# Altium project PCB_Linefollower.PrjPcb
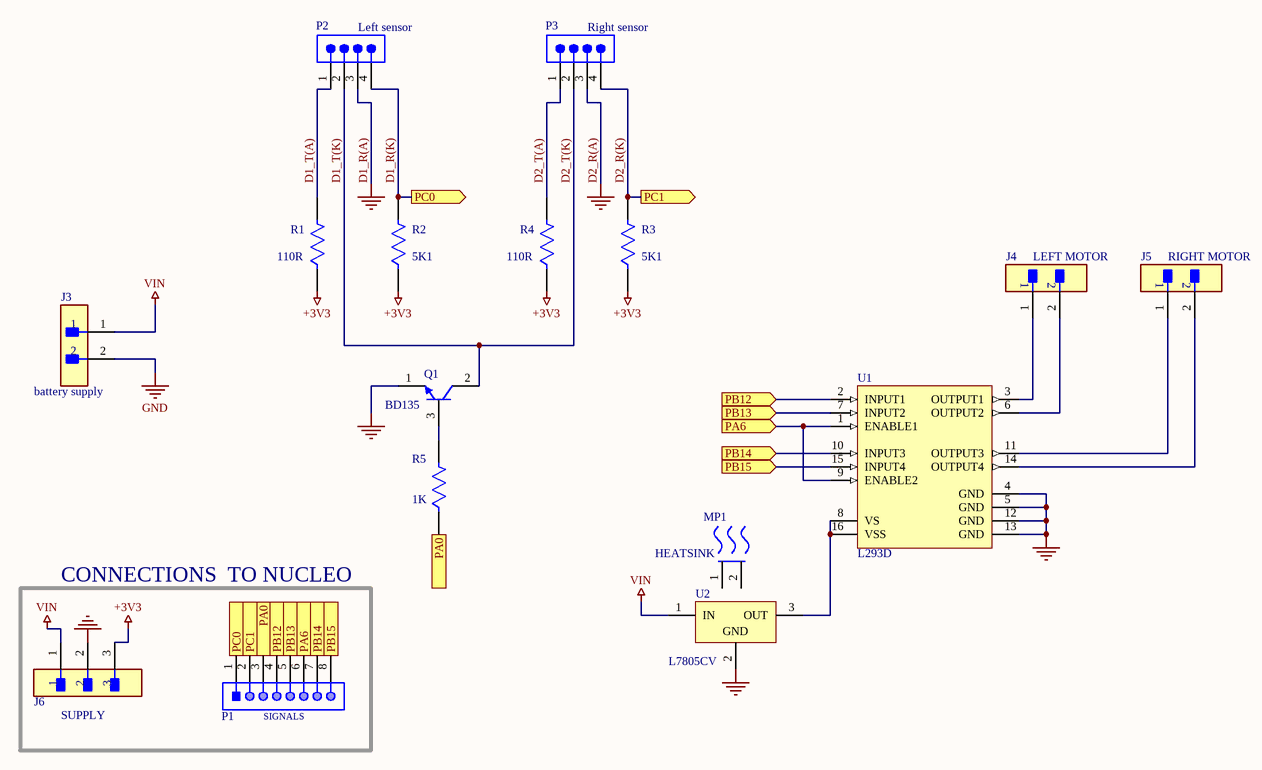
[diagram p0: Sheet1.SchDoc]
1 sheet, 16 parts. Net scope: flat (ports and power ports of the same name join across sheets).
Board file: Linefollower_pcb.PcbDoc

## Sheet Sheet1.SchDoc: schema
size A4; Author: Jacek Twardoch; DrawnBy: Jacek Twardoch; SheetNumber: 1; SheetTotal: 1

### Parts
J3  battery supply  [FP-M22-2510205-MFG]
J4  LEFT MOTOR  [FP-M22-2510205-MFG]
J5  RIGHT MOTOR  [FP-M22-2510205-MFG]
J6  SUPPLY  [FP-951103-8622-AR-MFG]
MP1  HEATSINK  [FP-E2A-T220-25E-MFG]
P1  SIGNALS  [61300811121]
P2  Left sensor  [SMTC-TSW-104-08-X-S]
P3  Right sensor  [SMTC-TSW-104-08-X-S]
Q1  BD135  [ONSC-TO-225-3-77-09]
R1  110R  [FP-MRS25-MFG]
R2  5K1  [FP-MRS25-MFG]
R3  5K1  [FP-MRS25-MFG]
R4  110R  [FP-MRS25-MFG]
R5  1K  [FP-MRS25-MFG]
U1  L293D  [STM-L293D-16]
U2  L7805CV  [TO220]

### Blocks framed on the sheet
CONNECTIONS  TO NUCLEO: J6 P1

### Ports
PA0 (in), PA0 (out), PA6 (in), PA6 (out), PB12 (in), PB12 (out), PB13 (in), PB13 (out), PB14 (in), PB14 (out), PB15 (in), PB15 (out), PC0 (in), PC0 (out), PC1 (in), PC1 (out)

### Nets
+3V3: J6.3 R1.1 R2.1 R3.1 R4.1
D1_R(A): J3.2 J6.2 P2.3 P3.3 Q1.1(E) U1.4(GND) U1.5(GND) U1.12(GND) U1.13(GND) U2.2(GND)  [also labelled D2_R(A), GND]
VIN: J3.1 J6.1 U2.1(IN)
D1_R(K): P1.1 P2.4 R2.2 ; port PC0
D1_T(A): P2.1 R1.2
D1_T(K): P2.2 P3.2 Q1.2(C)  [also labelled D2_T(K)]
D2_R(K): P1.2 P3.4 R3.2 ; port PC1
D2_T(A): P3.1 R4.2
NetJ4_1: J4.1 U1.3(OUTPUT1)
NetJ4_2: J4.2 U1.6(OUTPUT2)
NetJ5_1: J5.1 U1.11(OUTPUT3)
NetJ5_2: J5.2 U1.14(OUTPUT4)
NetP1_3: P1.3 R5.1 ; port PA0
NetP1_4: P1.4 U1.2(INPUT1) ; port PB12
NetP1_5: P1.5 U1.7(INPUT2) ; port PB13
NetP1_6: P1.6 U1.1(ENABLE1) U1.9(ENABLE2) ; port PA6
NetP1_7: P1.7 U1.10(INPUT3) ; port PB14
NetP1_8: P1.8 U1.15(INPUT4) ; port PB15
NetQ1_3: Q1.3(B) R5.2
NetU1_8: U1.8(VS) U1.16(VSS) U2.3(OUT)

Not connected (* = marked no-connect by the designer): MP1 1(MNT_1) 2(MNT_2)

### Library data of the parts
J3-J5 = CMP-15831-000005-1: CONN HEADER VERT 2POS 2MM; Manufacturer: Harwin; Manufacturer Part Number: M22-2510205; Conn Gender: Male; Current Rating: 2A; Number Of Contacts: 2; Conn Orientation: Vertical; Temperature Range Low: -40°C; Device Class L1: Connectors; ComponentLink2URL: https://cdn.harwin.com/pdfs/C018XX_M22_Series_Connectors.pdf; Temperature Range High: +105°C; Pitch: 2mm; Number Of Rows: 1; Temperature: -40°C to +105°C; Automotive: No; Device Class L3: unset; Octopart: https://octopart.com/m22-2510205-harwin-2538221; Mouser Description: Headers & Wire Housings 2 PIN SIL VERTICAL GOLD PIN HEADER; Height: 5.45mm; Category: Conn; Digikey Description: CONN HEADER VERT 2POS 2MM; Contact Material: Gold,Nickel; Lead Free: Yes; ComponentLink2Description: Datasheet; Device Class L2: Headers and Wire Housings; Package: 0; Footprint Url: https://cdn.harwin.com/pdfs/M22-251.pdf; RoHS: TRUE
J6 = CMP-05379-000003-1: CONN HEADER VERT 3POS 2MM; Manufacturer Part Number: 951103-8622-AR; Manufacturer: 3M; Conn Gender: Male; Current Rating: 2A; Number Of Contacts: 3; Conn Orientation: Straight; Digikey Description: CONN HEADER VERT 3POS 2MM; Device Class L3: unset; Category: Conn; Height: 6.3mm; RoHS: TRUE; Contact Material: Gold,Nickel; ComponentLink2Description: Datasheet; Temperature Range Low: -55°C; Device Class L1: Connectors; Pitch: 2mm; Mouser Description: Header; PinStrip; CopperAlloy; HighTempThermoplastic; 3Cnts; 1A; RtAngle; 951Series; Octopart: https://octopart.com/951103-8622-ar-3m-14400669; Package: 951103-8622-AR; Lead Free: Yes; Device Class L2: Headers and Wire Housings; Temperature Range High: +125°C; ComponentLink2URL: http://multimedia.3m.com/mws/media/1400506O/3m-pin-strip-header-951-series-78-5100-2653-3.pdf; Automotive: No; Temperature: -55°C to +125°C; Number Of Rows: 1
MP1 = CMP-33535-000011-1: BLACK ANODIZED HEATSINK; Thermal Resistance @ Forced Air Flow (100 LFM): 4°C/W; Natural Thermal Resistance: 16.4°C/W; Package Cooled: TO-220; Shape: Fins; Mount: Bolt; RoHS Compliant: Yes; Material: Aluminium
P1 = CMP-1502-01076-1: THT Vertical Pin Header WR-PHD, Pitch 2.54 mm, Single Row, 8 pins; Manufacturer: Wurth Elektronik; Rated Current: 3A; Pin Number: 8; Working Voltage: 250VAC; Gender: Male; Contact Resistance: 20mOhm; Pitch: 2.54mm; Withstanding Voltage: 500VAC; Publisher: WurthElektronik; Operating Temperature: -40to105degC; Orientation: Vertical; Row Number: Single; Part Number: 61300811121; Package Reference: 61300811121; Mounting Technology: THT; Packaging: Bag; Manufacturer URL: http://www.we-online.de; Datasheet URL: https://katalog.we-online.de/em/datasheet/6130xx11121.pdf
P2 P3 = CMP-1024-00358-1: 0.025" SQ Post Header, Through-hole, Vertical, -55 to 125 degC, 2.54 mm Pitch, 4-Pin, Male, RoHS; PartNumber: TSW-104-08-L-S; Manufacturer: Samtec; Pitch: 2.54 mm; RoHS: True; Temperature Range: -55 to 125 degC; PackageDescription: .025[0.64] SQ. Post Terminal Strip Assembly; Orientation: Vertical; ComponentLink2URL: http://www.samtec.com/documents/webfiles/pdf/TSW_TH.PDF; ComponentLink1Description: Manufacturer URL; ComponentLink2Description: Datasheet; PackageVersion: DM, 8/1988; ComponentLink3URL: http://www.samtec.com/documents/webfiles/cpdf/TSW-XXX-XX-XXX-X-XX-XXX-MKT.pdf; Mounting Technology: Through-hole; PackageReference: TSW-104-08-X-S; ComponentLink3Description: Package Specification; ComponentLink1URL: http://www.samtec.com; DatasheetVersion: F-214
Q1 = CMP-1048-01272-1: Plastic Medium-Power Silicon NPN Transistor, 3-Pin TO-225, Bulk Box; Manufacturer: On Semiconductor; IC Continuous (A): 1.5; Polarity: NPN; ComponentLink2URL: http://www.onsemi.com/pub_link/Collateral/BD135-D.PDF; PackageReference: TO-225-3-77-09; PartNumber: BD135; ComponentLink3Description: Package Specification; PackageDescription: 3-Pin Flange Mount, Vertical Straight Lead, Body 7.6 x 2.7 mm, Pitch 2.29 mm; Mounting Technology: Through Hole; ComponentLink3URL: http://www.onsemi.com/pub_link/Collateral/77-09.PDF; RoHS: FALSE; PackageVersion: Rev. AC, 12/2013; ComponentLink2Description: Datasheet; Packing: Bulk Box; ComponentLink1Description: Manufacturer URL; ComponentLink1URL: http://www.onsemi.com/; DatasheetVersion: Rev. 16
R1-R5 = CMP-02408-000003-1: RES 1.1K OHM 0.6W 1% AXIAL; Manufacturer: Vishay BC Components; Manufacturer Part Number: MRS25000C1101FCT00; Voltage Rating: 350V; Resistance: 1.1kΩ; Temperature Coefficient: 50ppm/°C; Value: 1.1kΩ; Device Class L1: Passive Components; Height: 2.5mm; Octopart: https://octopart.com/mrs25000c1101fct00-vishay-43740214; Temperature Range Low: -55°C; Temperature: -55°C to +155°C; Temperature Range High: +155°C; Lead Free: Yes; Mouser Description: Thin Film Resistors .6watt 1.1Kohms 1%; Power Rating: 0.6W; Digikey Description: RES 1.1K OHM 0.6W 1% AXIAL; RoHS: TRUE; Tolerance: 1%; Package: MRS25; Device Class L3: Through-Hole Resistors; ComponentLink2URL: http://www.vishay.com/docs/28724/mrs16m25.pdf; ComponentLink2Description: Datasheet; Composition: Thin Film; Automotive: No; Ipc Land Pattern Name: RESAD1000W75L650D250; Device Class L2: Resistors; Category: Res; Series: MRS25
U1 = CMP-2000-06524-1: Push-Pull Four Channel Driver with Diode, 4.5 to 36 V, -40 to 150 degC, 16-Pin PDIP, RoHS, Tube; Manufacturer: STMicroelectronics; Number of Outputs: 4; Current - Peak Output: 1.2A; Current - Output / Channel: 600mA; Input Type: Non-Inverting; Other Related Documents: L293DViewAllSpecifications; Dynamic Catalog: HalfBridge; Voltage - Supply: 4.5V~36V; Other Names: 497-2936-5; Package / Case: 16-DIP(0.300",7.62mm); PartNumber: L293D; Operating Temperature: -40°C~150°C; Datasheet URL: http://www.st.com/st-web-ui/static/active/en/resource/technical/document/datasheet/CD00000059.pdf; Supplier Device Package: 16-PowerDIP; Packaging: Tube; Package Description: 16-Pin Thru-Hole Dual-In-Line, Body 20 x 6.85 mm, Pitch 2.54 mm; Standard Package: 25; Datasheet Version: 07/2003; On-State Resistance: -; Manufacturer URL: http://www.st.com/; Category: IntegratedCircuits(ICs); Family: PMIC-MOSFET,BridgeDrivers-InternalSwitch; Type: HalfBridge; Series: -; Mounting Technology: ThroughHole; Package Reference: DIP-16; Mounting Type: ThroughHole
U2 = CMP-0244-00483-1: Positive Voltage Regulator, 5V, 3-Pin TO-220; PackageDescription: TO, Thru-Hole, Vertical, Heatsink Mounted; 3 In-Line Leads; Pitch 2.54 mm; ComponentLink2Description: Datasheet; PackageReference: TO220; ComponentLink3URL: http://www.st.com/internet/com/TECHNICAL_RESOURCES/TECHNICAL_LITERATURE/PACKAGE_INFORMATION/CD00004649.pdf; DatasheetVersion: 16/11/2011; ComponentLink1Description: Manufacturer URL; ComponentLink1URL: http://www.st.com; PackageVersion: ver3.0; ComponentLink3Description: Package Specification; ComponentLink2URL: http://www.st.com/internet/com/TECHNICAL_RESOURCES/TECHNICAL_LITERATURE/DATASHEET/CD00000444.pdf